# Altium schematic sheet Sheet1.SchDoc
size A; SheetNumber: 1; SheetTotal: 3
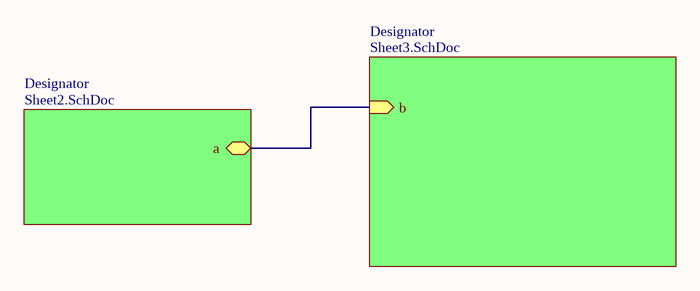
[diagram p0: Sheet1.SchDoc]

## Sub-sheets
Designator = Sheet2.SchDoc: a (bidir)
Designator = Sheet3.SchDoc: b (in)

## Nets
(unnamed): sheet Designator/a, sheet Designator/b